# EAGLE schematic the-ftdiy (EAGLE 9.3.2)
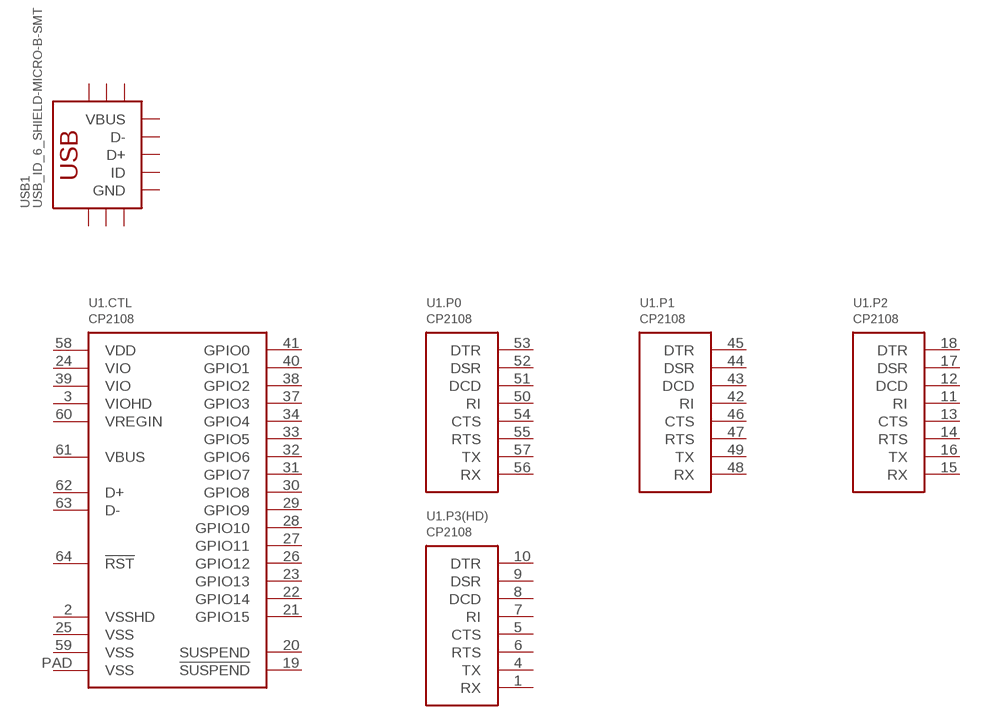
[diagram p0: schematic, sheet 1]

## Parts
U1  CP2108  [QFN64]
USB1  USB_ID_6_SHIELD-MICRO-B-SMT  [USB-UB-SMT]
Unconnected: U1.1(.P3(HD):RX) U1.2(.CTL:VSSHD) U1.3(.CTL:VIOHD) U1.4(.P3(HD):TX) U1.5(.P3(HD):CTS) U1.6(.P3(HD):RTS) U1.7(.P3(HD):RI) U1.8(.P3(HD):DCD) U1.9(.P3(HD):DSR) U1.10(.P3(HD):DTR) U1.11(.P2:RI) U1.12(.P2:DCD) U1.13(.P2:CTS) U1.14(.P2:RTS) U1.15(.P2:RX) U1.16(.P2:TX) U1.17(.P2:DSR) U1.18(.P2:DTR) U1.19(.CTL:!SUSPEND) U1.20(.CTL:SUSPEND) U1.21(.CTL:GPIO15) U1.22(.CTL:GPIO14) U1.23(.CTL:GPIO13) U1.24(.CTL:VIO) U1.25(.CTL:VSS) U1.26(.CTL:GPIO12) U1.27(.CTL:GPIO11) U1.28(.CTL:GPIO10) U1.29(.CTL:GPIO9) U1.30(.CTL:GPIO8) U1.31(.CTL:GPIO7) U1.32(.CTL:GPIO6) U1.33(.CTL:GPIO5) U1.34(.CTL:GPIO4) U1.37(.CTL:GPIO3) U1.38(.CTL:GPIO2) U1.39(.CTL:VIO) U1.40(.CTL:GPIO1) U1.41(.CTL:GPIO0) U1.42(.P1:RI) U1.43(.P1:DCD) U1.44(.P1:DSR) U1.45(.P1:DTR) U1.46(.P1:CTS) U1.47(.P1:RTS) U1.48(.P1:RX) U1.49(.P1:TX) U1.50(.P0:RI) U1.51(.P0:DCD) U1.52(.P0:DSR) U1.53(.P0:DTR) U1.54(.P0:CTS) U1.55(.P0:RTS) U1.56(.P0:RX) U1.57(.P0:TX) U1.58(.CTL:VDD) U1.59(.CTL:VSS) U1.60(.CTL:VREGIN) U1.61(.CTL:VBUS) U1.62(.CTL:D+) U1.63(.CTL:D-) U1.64(.CTL:!RST) U1.PAD(.CTL:VSS) USB1.D+ USB1.D- USB1.GND USB1.ID USB1.SHIELD1(SHIELD) USB1.SHIELD2(SHIELD) USB1.SHIELD3(SHIELD) USB1.SHIELD4(SHIELD) USB1.SHIELD5(SHIELD) USB1.SHIELD6(SHIELD) USB1.VBUS

## Library data of the parts
U1 = Silicon Labs:CP2108
USB1 = USB Connector:USB_ID_6_SHIELD